# EAGLE design esp8266heaterv01 (EAGLE 8.0.2)
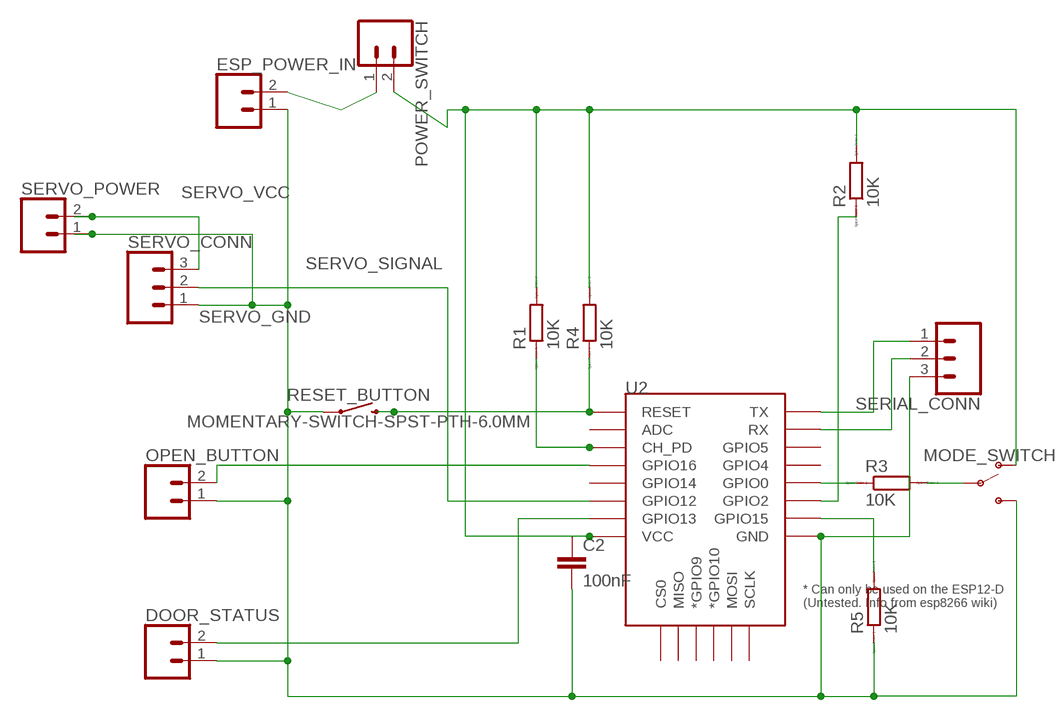
[diagram p0: schematic, sheet 1]

## Parts
C2  100nF  C-EU025-024X044  [C025-024X044]
DOOR_STATUS  CONN_02-JST-2-PTH-NO_SILK  [JST-2-PTH-NS]
ESP_POWER_IN  CONN_02JST-PTH-2  [JST-2-PTH]
MODE_SWITCH  SWITCH-SPDT-PTH-11.6X4.0MM  [SWITCH_SPDT_PTH_11.6X4.0MM]
OPEN_BUTTON  CONN_02-JST-2-PTH-NO_SILK  [JST-2-PTH-NS]
POWER_SWITCH  CONN_02-JST-2-PTH-NO_SILK  [JST-2-PTH-NS]
R1  10K  R0204/7  [0204/7]
R2  10K  R0204/7  [0204/7]
R3  10K  R0204/7  [0204/7]
R4  10K  R0204/7  [0204/7]
R5  10K  R0204/7  [0204/7]
RESET_BUTTON  MOMENTARY-SWITCH-SPST-PTH-6.0MM  [TACTILE_SWITCH_PTH_6.0MM]
SERIAL_CONN  CONN_03POGO_PIN_HOLES_ONLY  [1X03_PP_HOLES_ONLY]
SERVO_CONN  CONN_03  [1X03]
SERVO_POWER  CONN_02JST-PTH-2  [JST-2-PTH]
U2  ESP12ESMD  [ESP12E-SMD]

## Nets
N$1: C2.1 MODE_SWITCH.1(O) POWER_SWITCH.2 R1.2 R2.2 R4.2 U2.VCC
N$2: OPEN_BUTTON.2 U2.GPIO16
N$3: R3.1 U2.GPIO0
N$4: R4.1 RESET_BUTTON.3 U2.RESET
N$5: R1.1 U2.CH_PD
N$6: R5.2 U2.GPIO15
N$7: MODE_SWITCH.2(P) R3.2
N$8: SERIAL_CONN.1 U2.TXD0(TX)
N$9: SERIAL_CONN.2 U2.RXD0(RX)
N$10: DOOR_STATUS.2 U2.GPIO13
N$12: R2.1 U2.GPIO2
N$15: ESP_POWER_IN.2 POWER_SWITCH.1
N$17: C2.2 DOOR_STATUS.1 MODE_SWITCH.3(S) OPEN_BUTTON.1 R5.1 SERIAL_CONN.3 U2.GND
SERVO_GND: ESP_POWER_IN.1 RESET_BUTTON.1 SERVO_CONN.1 SERVO_POWER.1
SERVO_SIGNAL: SERVO_CONN.2 U2.GPIO12
SERVO_VCC: SERVO_CONN.3 SERVO_POWER.2
Unconnected: U2.ADC U2.CS0 U2.GPIO4 U2.GPIO5 U2.GPIO9(*GPIO9) U2.GPIO10(*GPIO10) U2.GPIO14 U2.MISO U2.MOSI U2.SCLK

## Library data of the parts
C2 = resistor:C-EU: CAPACITOR, European symbol
DOOR_STATUS OPEN_BUTTON POWER_SWITCH = SparkFun-Connectors:CONN_02: Multi connection point. Often used as Generic Header-pin footprint for 0.1 inch spaced/style header connections On any of the 0.1 inch spaced packages, you can populate with these: Break Away Headers - Straight <https://www.sparkfun.com/products/116> (PRT-00116) Break Away Male Headers - Right Angle <https://www.sparkfun.com/products/553> (PRT-00553) Female Headers <https://www.sparkfun.com/products/115> (PRT-00115) Break Away Headers - Machine Pin <https://www.sparkfun.com/products/117> (PRT-00117) Break Away Female Headers - Swiss Machine Pin <https://www.sparkfun.com/products/743> (PRT-00743) For SCREWTERMINALS and SPRING TERMINALS visit here: Screw Terimnals on SparkFun.com <https://www.sparkfun.com/search/results?term=Screw+Terminals> (5mm/3.5mm/2.54mm spacing) This device is also useful as a general connection point to wire up your design to another part of your project. Our various solder wires solder well into these plated through hole pads. Hook-Up Wire - Assortment (Stranded, 22 AWG) <https://www.sparkfun.com/products/11375> (PRT-11375) Hook-Up Wire - Assortment (Solid Core, 22 AWG) <https://www.sparkfun.com/products/11367> (PRT-11367) View the entire wire category on our website here <https://www.sparkfun.com/categories/141> Special notes: Molex polarized connector foot print use with: PRT-08233 with associated crimp pins and housings. 2.54_SCREWTERM for use with PRT-10571. 3.5mm Screw Terminal footprints for PRT-08084 5mm Screw Terminal footprints for use with PRT-08432
ESP_POWER_IN SERVO_POWER = sparkfun-con.:CONN_02: Multi connection point. Often used as Generic Header-pin footprint for 0.1 inch spaced/style header connections On any of the 0.1 inch spaced packages, you can populate with these: Break Away Headers - Straight <https://www.sparkfun.com/products/116> (PRT-00116) Break Away Male Headers - Right Angle <https://www.sparkfun.com/products/553> (PRT-00553) Female Headers <https://www.sparkfun.com/products/115> (PRT-00115) Break Away Headers - Machine Pin <https://www.sparkfun.com/products/117> (PRT-00117) Break Away Female Headers - Swiss Machine Pin <https://www.sparkfun.com/products/743> (PRT-00743) For SCREWTERMINALS and SPRING TERMINALS visit here: Screw Terimnals on SparkFun.com <https://www.sparkfun.com/search/results?term=Screw+Terminals> (5mm/3.5mm/2.54mm spacing) This device is also useful as a general connection point to wire up your design to another part of your project. Our various solder wires solder well into these plated through hole pads. Hook-Up Wire - Assortment (Stranded, 22 AWG) <https://www.sparkfun.com/products/11375> (PRT-11375) Hook-Up Wire - Assortment (Solid Core, 22 AWG) <https://www.sparkfun.com/products/11367> (PRT-11367) View the entire wire category on our website here <https://www.sparkfun.com/categories/141> Special notes: Molex polarized connector foot print use with: PRT-08233 with associated crimp pins and housings. 2.54_SCREWTERM for use with PRT-10571. 3.5mm Screw Terminal footprints for PRT-08084 5mm Screw Terminal footprints for use with PRT-08432; PROD_ID: CONN-09863; SKU: PRT-09914
MODE_SWITCH = SparkFun-Switches:SWITCH-SPDT: Single Pole, Double Throw (SPDT) Switch Single-pole, double-throw (SPDT) switch. Variant Overview SMD-AYZ0202 Surface Mount DPDT Switch <https://www.sparkfun.com/products/597> (COM-00597) Used on e.g. LilyPad Arduino USB - ATmega32U4 Board <https://www.sparkfun.com/products/12049> PTH-11.6X4.0MM SPDT Mini Power Switch <https://www.sparkfun.com/products/102> (COM-00102) Used on e.g. SparkFun Simon Says - Through-Hole Soldering Kit <https://www.sparkfun.com/products/10547> (KIT-10547) PTH-11.6X4.0MM-KIT KIT version of SPDT Mini Power Switch - Simplifies soldering by removing tStop of switch pins - only one side can be soldered. PTH-11.6X4.0MM-LOCK LOCK version of SPDT Mini Power Switch - Offset pins hold switch in place for easier soldering. SMD-RIGHT-ANGLE Surface Mount Right Angle Switch <https://www.sparkfun.com/products/10860> (COM-10860) Used on e.g. SparkFun ESP8266 Thing <https://www.sparkfun.com/products/13231>; PROD_ID: SWCH-08261; SF_SKU: COM-00102
R1-R5 = eagle-ltspice:R: RESISTOR, European symbol; SPICEMODEL: NONE; SPICEPREFIX: R
RESET_BUTTON = SparkFun-Switches:MOMENTARY-SWITCH-SPST: Momentary Switch (Pushbutton) - SPST Normally-open (NO) SPST momentary switches (buttons, pushbuttons). Variants PTH-12MM - 12mm square, through-hole Momentary Pushbutton Switch - 12mm Square <https://www.sparkfun.com/products/9190> (COM-09190) PTH-6.0MM, PTH-6.0MM-KIT - 6.0mm square, through-hole Mini Pushbutton Switch <https://www.sparkfun.com/products/97> (COM-00097) KIT package intended for soldering kit's - only one side of pads' copper is exposed. PTH-RIGHT-ANGLE-KIT - Right-angle, through-hole Right Angle Tactile Button <https://www.sparkfun.com/products/10791> - Used on SparkFun BigTime Watch Kit <https://www.sparkfun.com/products/11734> SMD-12MM - 12mm square, surface-mount Tactile Button - SMD (12mm) <https://www.sparkfun.com/products/12993> (COM-12993) Used on SparkFun PicoBoard <https://www.sparkfun.com/products/11888> SMD-4.5MM - 4.5mm Square Trackball Switch Used on SparkFun Blackberry Trackballer Breakout <https://www.sparkfun.com/products/13169> SMD-4.6MMX2.8MM - 4.60mm x 2.80mm, surface mount Used on SparkFun SAMD21 Mini Breakout <https://www.sparkfun.com/products/13664> SMD-5.2MM, SMD-5.2-REDUNDANT - 5.2mm square, surface-mount Mini Pushbutton Switch - SMD <https://www.sparkfun.com/products/8720> (COM-08720) Used on Arduino Pro Mini <https://www.sparkfun.com/products/11114> REDUNDANT package connects both switch circuits together SMD-6.0X3.5MM - 6.0 x 3.5mm, surface mount Momentary Reset Switch SMD <https://www.sparkfun.com/products/8229> (COM-08229) SMD-6.2MM-TALL - 6.2mm square, surface mount Tactile Button - SMD (6mm) <https://www.sparkfun.com/products/12992> Used on SparkFun Digital Sandbox <https://www.sparkfun.com/products/12651> SMD-RIGHT-ANGLE - Right-angle, surface mount Used on SparkFun Block for Intel® Edison - Arduino <https://www.sparkfun.com/products/13036>; PROD_ID: SWCH-08441; SF_SKU: COM-00097
SERIAL_CONN SERVO_CONN = SparkFun-Connectors:CONN_03: Multi connection point. Often used as Generic Header-pin footprint for 0.1 inch spaced/style header connections On any of the 0.1 inch spaced packages, you can populate with these: Break Away Headers - Straight <https://www.sparkfun.com/products/116> (PRT-00116) Break Away Male Headers - Right Angle <https://www.sparkfun.com/products/553> (PRT-00553) Female Headers <https://www.sparkfun.com/products/115> (PRT-00115) Break Away Headers - Machine Pin <https://www.sparkfun.com/products/117> (PRT-00117) Break Away Female Headers - Swiss Machine Pin <https://www.sparkfun.com/products/743> (PRT-00743) Stackable Header - 3 Pin (Female, 0.1") <https://www.sparkfun.com/products/13875> (PRT-13875) For SCREWTERMINALS and SPRING TERMINALS visit here: Screw Terimnals on SparkFun.com <https://www.sparkfun.com/search/results?term=Screw+Terminals> (5mm/3.5mm/2.54mm spacing) This device is also useful as a general connection point to wire up your design to another part of your project. Our various solder wires solder well into these plated through hole pads. Hook-Up Wire - Assortment (Stranded, 22 AWG) <https://www.sparkfun.com/products/11375> (PRT-11375) Hook-Up Wire - Assortment (Solid Core, 22 AWG) <https://www.sparkfun.com/products/11367> (PRT-11367) View the entire wire category on our website here <https://www.sparkfun.com/categories/141> Special notes: Molex polarized connector foot print use with SKU : PRT-08232 with associated crimp pins and housings.
U2 = esp8266modules:ESP12E: ESP12E Module

## Board
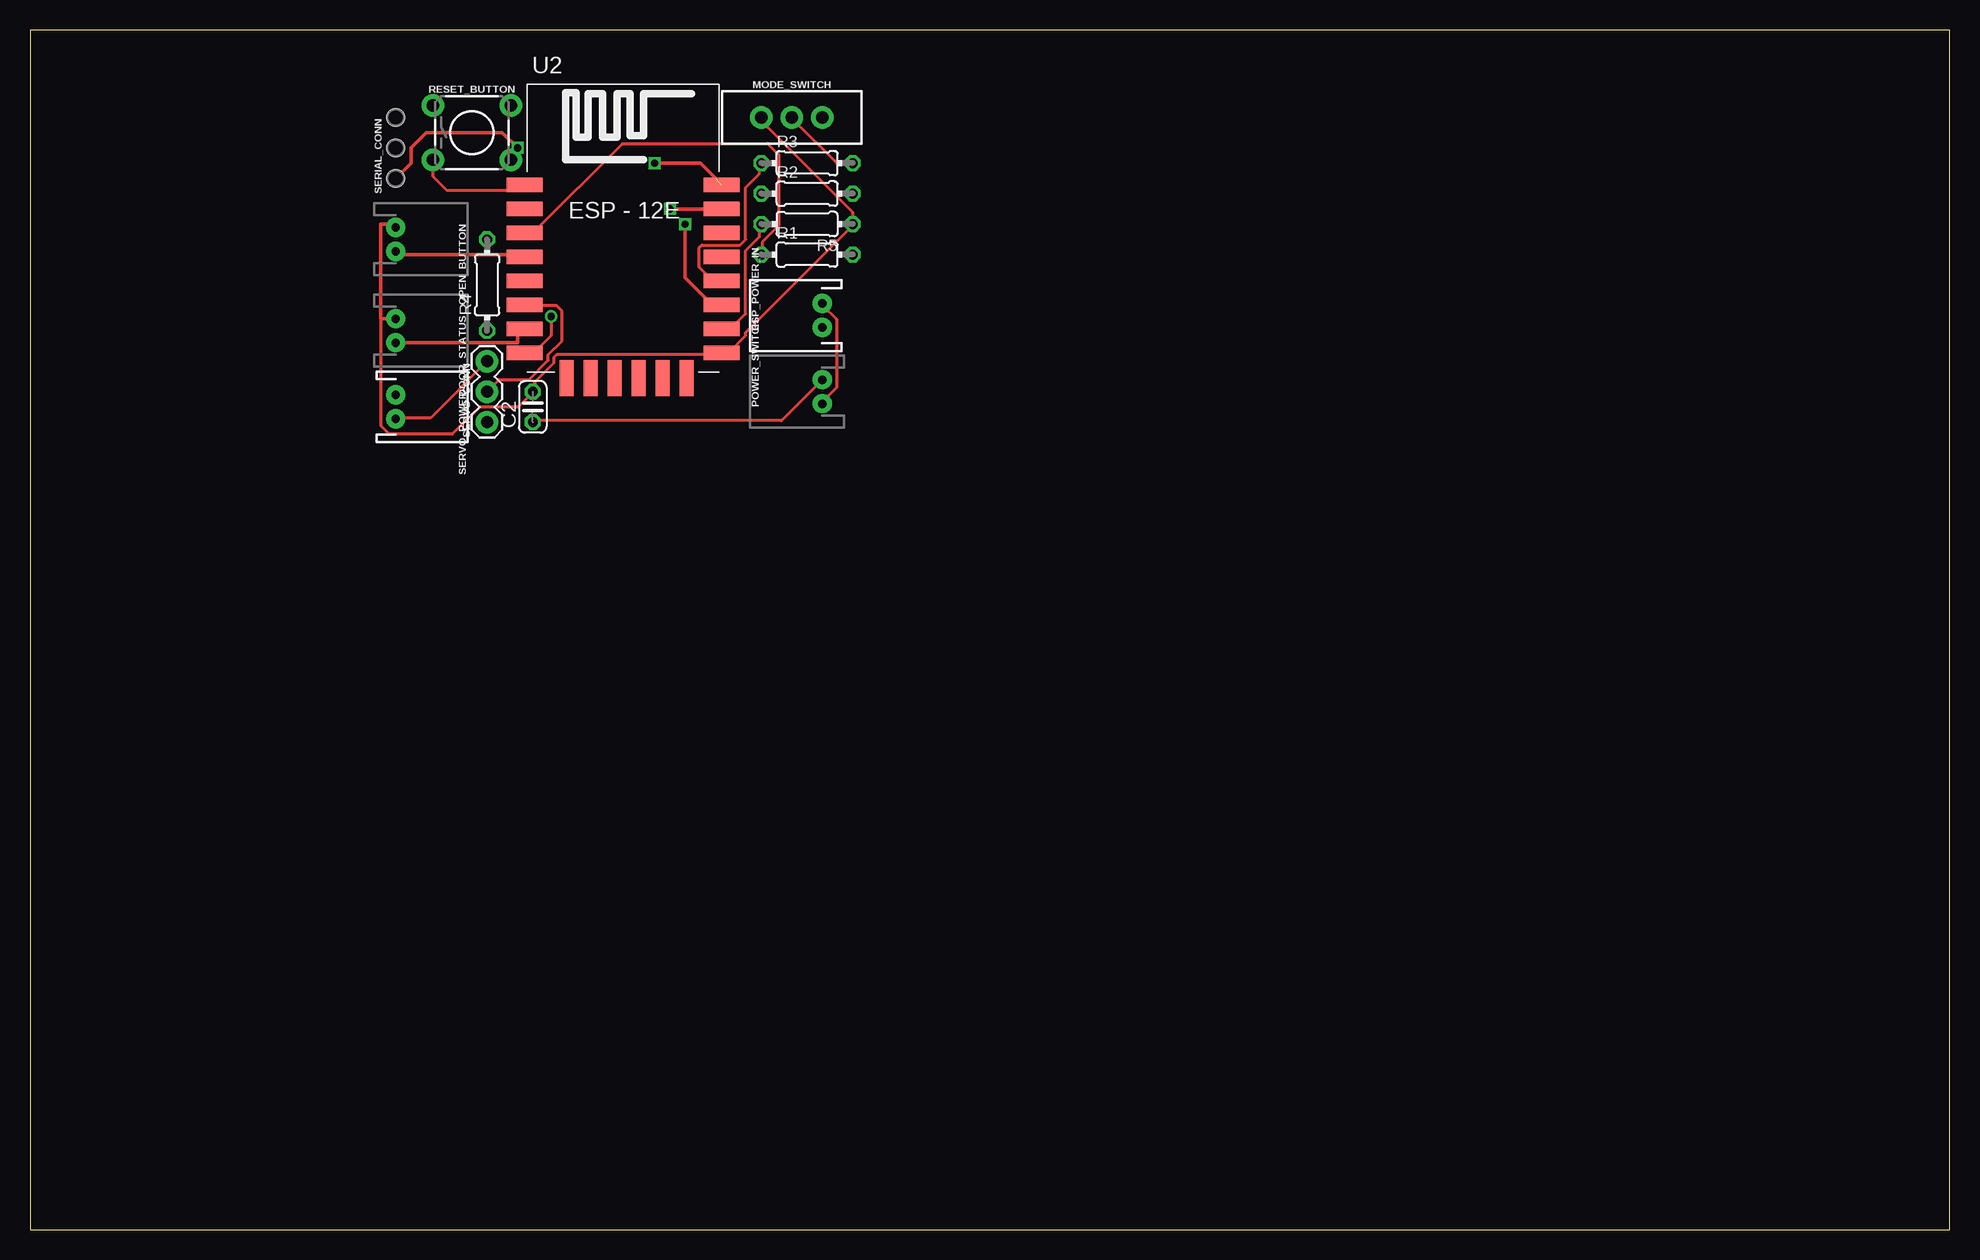
[diagram p1: board, top side]
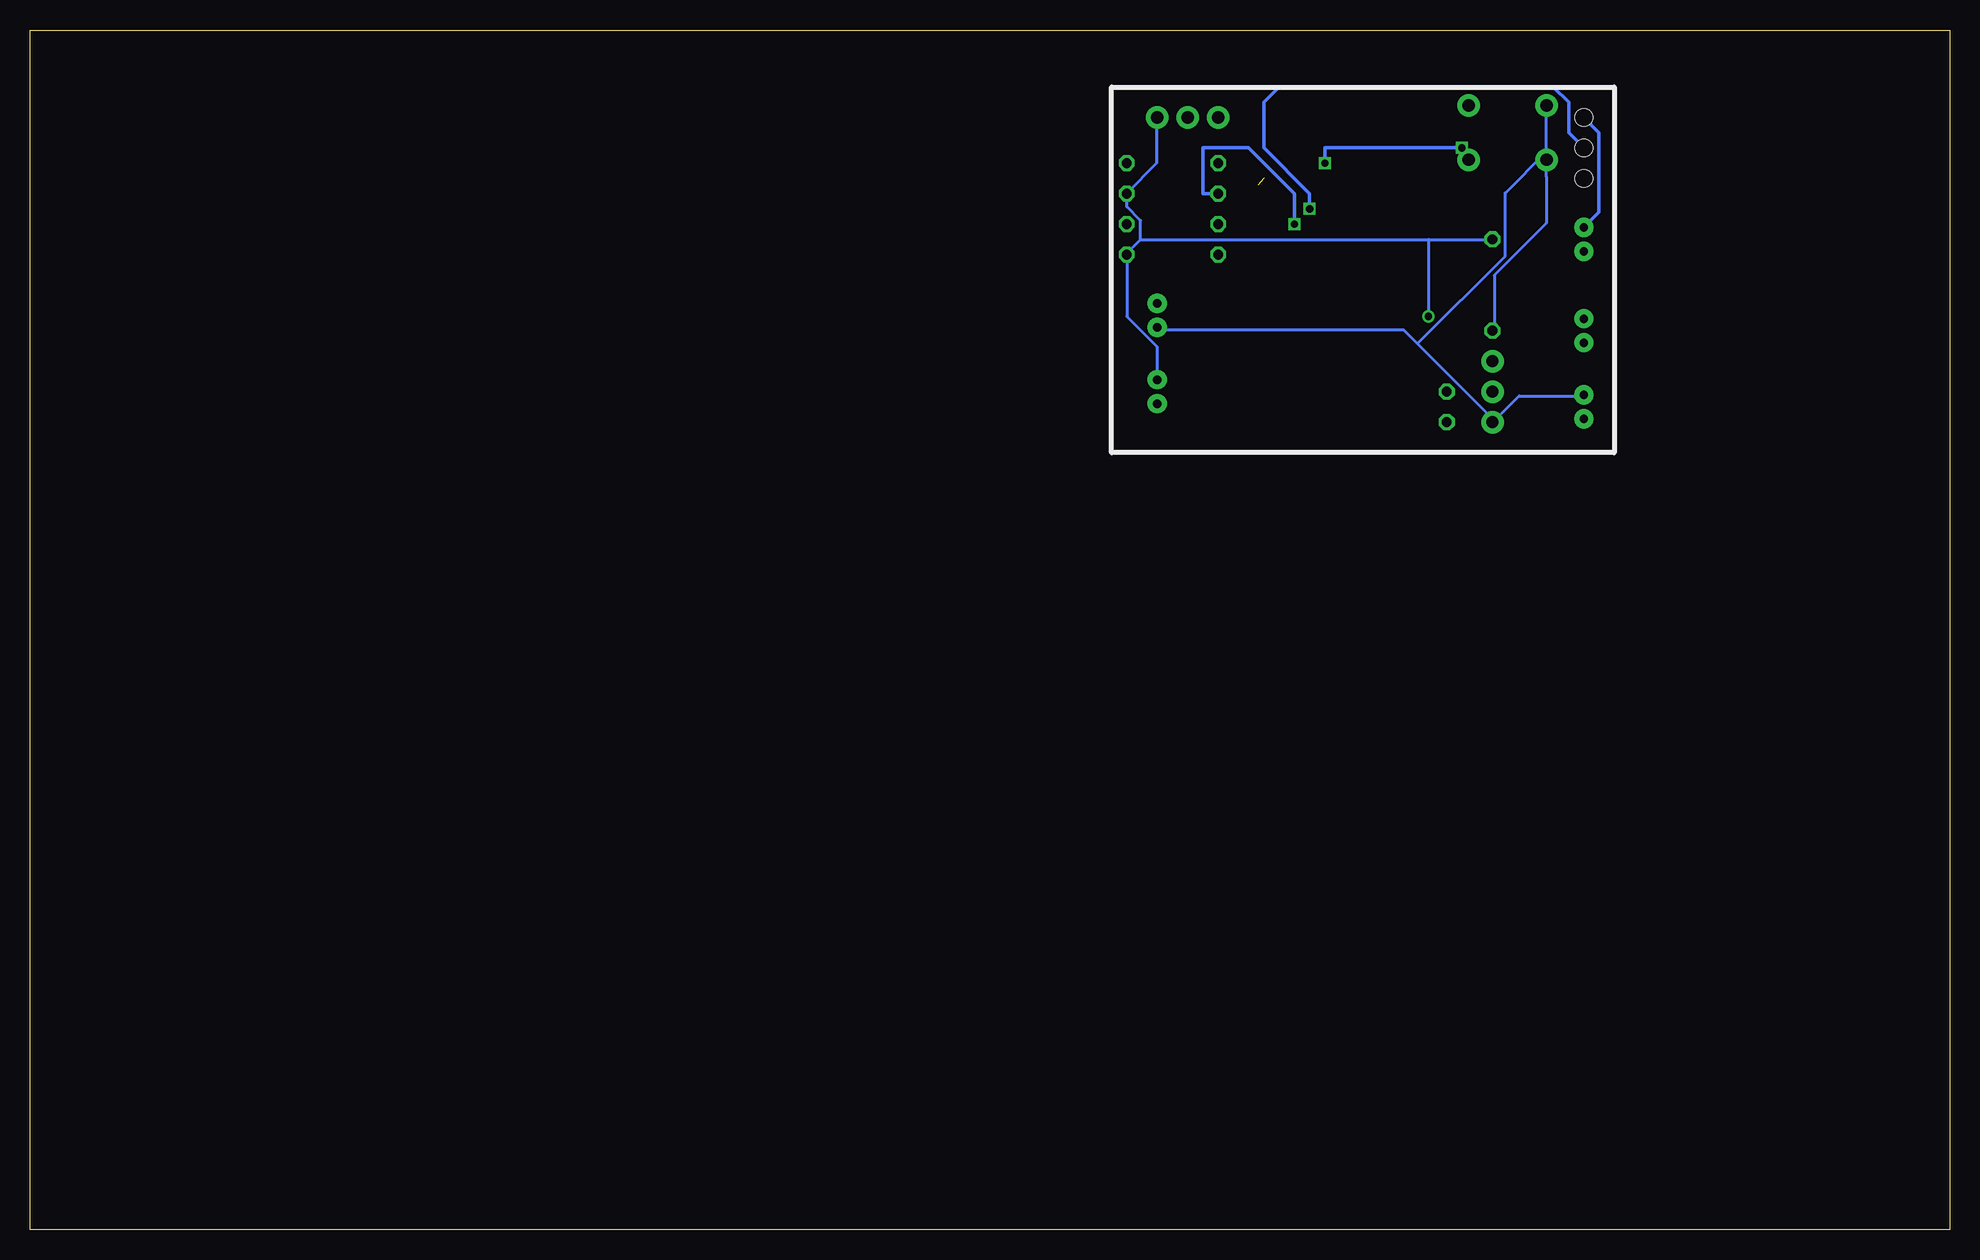
[diagram p2: board, bottom side, seen from below]

Size 160 x 100 mm. Coordinates in mm from the lower left corner, seen from the top.
Outline: 0,0 160,0 160,100 0,100 0,0
Copper layers (1*16): Top 0.035mm / dielectric 1.5mm / Bottom 0.035mm
Design rules "default": minimum track width 10mil, minimum drill 24mil, track to track 8mil, track to pad 8mil, pad to pad 8mil, via to via 8mil, smd to smd 8mil, copper to edge 40mil, drill to drill 8mil, minimum pad ring 10mil, minimum via ring 8mil, stop-mask expansion 4mil, vias tented up to drill 0mil, thermal gap 10mil

### Footprints (pad centres in the part's own frame; a part is rotated, then mirrored left to right if it is on the bottom)
C025-024X044 = drill 0.813 octagon: 1 -1.27,0; 2 1.27,0
JST-2-PTH-NS = drill 0.7 pad 1.6: 1 -1,0; 2 1,0
JST-2-PTH = drill 0.7 pad 1.6: 1 -1,0; 2 1,0
SWITCH_SPDT_PTH_11.6X4.0MM = drill 1.016 pad 1.88: 1 0,2.54; 2 0,0; 3 0,-2.54
0204/7 = drill 0.813 octagon: 1 -3.81,0; 2 3.81,0
TACTILE_SWITCH_PTH_6.0MM = drill 1.016 pad 1.88: 1 -3.251,2.261; 2 3.251,2.261; 3 -3.251,-2.261; 4 3.251,-2.261
1X03_PP_HOLES_ONLY = drill 0.9 pad 0.813: 1 0,0; 2 2.54,0; 3 5.08,0 | hole 1.473: 0,0; 2.54,0; 5.08,0
1X03 = drill 1.016 pad 1.88: 1 0,0; 2 2.54,0; 3 5.08,0
ESP12E-SMD = smd 3 x 1.2: ADC -8.3,3.8; CH_PD -8.3,1.8; GND 8.1,-8.2; GPIO0 8.1,-2.2; GPIO2 8.1,-4.2; GPIO4 8.1,-0.2; GPIO5 8.1,1.8; GPIO12 -8.3,-4.2; GPIO13 -8.3,-6.2; GPIO14 -8.3,-2.2; GPIO15 8.1,-6.2; GPIO16 -8.3,-0.2; RESET -8.3,5.8; RXD0 8.1,3.8; TXD0 8.1,5.8; VCC -8.3,-8.2 | smd 1.2 x 3: CS0 -4.8,-10.3; GPIO9 -0.8,-10.3; GPIO10 1.2,-10.3; MISO -2.8,-10.3; MOSI 3.2,-10.3; SCLK 5.2,-10.3

### Placement (x,y rotation side)
C2  41.91,68.58 90 top
DOOR_STATUS  30.48,74.93 270 top
ESP_POWER_IN  66.04,76.2 90 top
MODE_SWITCH  63.5,92.71 270 top
OPEN_BUTTON  30.48,82.55 270 top
POWER_SWITCH  66.04,69.85 90 top
R1  64.77,81.28 0 top
R2  64.77,86.36 0 top
R3  64.77,88.9 0 top
R4  38.1,78.74 90 top
R5  64.77,83.82 180 top
RESET_BUTTON  36.83,91.44 0 top
SERIAL_CONN  30.48,87.63 90 top
SERVO_CONN  38.1,67.31 90 top
SERVO_POWER  30.48,68.58 270 top
U2  49.53,81.28 0 top

### Tracks (layer width: path | path; a pad name or v marks a point on that pad's centre or on a via)
N$1  (via drill 0.61)
  Top 0.254: C2.1 42.06,67.44 62.64,67.44 65.84,70.64 POWER_SWITCH.2 | v43.43,76.12 43.43,74.52 42.06,73.15 41.38,73.15 U2.VCC
  Bottom 0.254: 67.44,82.53 43.43,82.53 | 43.43,82.53 38.18,82.53 R4.2 | 67.44,82.53 68.58,81.38 R1.2 68.58,76.12 66.06,73.61 66.06,70.87 POWER_SWITCH.2 | 67.44,82.53 67.44,84.12 68.58,85.27 R2.2 68.58,86.41 66.06,88.92 66.06,92.58 MODE_SWITCH.1 | 43.43,82.53 v43.43,76.12
N$2
  Top 0.254: U2.GPIO16 41.15,81.15 40.69,81.15 40.64,81.28
  Top 0.305: OPEN_BUTTON.2 30.75,81.28 40.64,81.28
N$3
  Top 0.254: R3.1 60.81,88.7 60.81,88.01 59.66,86.87 59.66,82.53 59.21,82.07 56.01,82.07 55.78,81.84 55.78,80.24 56.92,79.1 57.61,79.1 U2.GPIO0
N$4
  Top 0.254: U2.RESET 41.15,86.87 40.92,86.87 40.69,86.64 34.75,86.64 33.6,87.78 RESET_BUTTON.3
  Bottom 0.254: R4.1 37.95,74.98 37.95,79.55 33.6,83.9 33.6,87.78 RESET_BUTTON.3
N$5
  Top 0.254: R1.1 61.04,81.38 61.04,82.3 62.41,83.67 62.41,89.61 61.49,90.53 49.38,90.53 42.06,83.21 41.38,83.21 U2.CH_PD
N$6
  Top 0.254: R5.2 60.81,83.67 60.81,82.75 59.66,81.61 59.66,76.35 58.52,75.21 57.84,75.21 U2.GPIO15
N$7
  Top 0.254: R3.2 68.58,88.92 67.21,88.92 63.55,92.58 MODE_SWITCH.2
N$8  (via drill 0.6)  (1 unrouted)
  Top 0.305: SERIAL_CONN.1 31.75,88.9 31.75,90.17 33.02,91.44 39.37,91.44 v40.64,90.17 | v52.07,88.9 55.88,88.9 57.15,87.63
  Bottom 0.305: v40.64,90.17 52.07,90.17 v52.07,88.9
N$9  (via drill 0.6)
  Top 0.305: v53.34,85.09 v53.35,85.08 U2.RXD0
  Bottom 0.305: SERIAL_CONN.2 31.75,91.44 31.75,93.98 33.02,95.25 55.88,95.25 57.15,93.98 57.15,90.17 53.34,86.36 v53.34,85.09
N$10
  Top 0.254: U2.GPIO13 41.15,74.98 40.69,74.98 40.64,74.93
  Top 0.305: DOOR_STATUS.2 40.64,73.93 40.64,74.93
N$12  (via drill 0.6)
  Top 0.254: 56.69,77.27 57.61,77.27 U2.GPIO2
  Top 0.305: v54.61,83.82 54.61,79.35 56.69,77.27
  Bottom 0.305: R2.1 62.23,86.36 62.23,90.17 58.42,90.17 54.61,86.36 v54.61,83.82
N$15
  Top 0.254: POWER_SWITCH.1 66.06,69.04 67.21,70.18 67.21,75.89 66.06,77.04 ESP_POWER_IN.2
N$17
  Top 0.254: MODE_SWITCH.3 60.81,92.58 68.58,84.81 R5.1 68.58,83.67 59.66,74.75 59.66,74.52 58.29,73.15 57.84,73.15 U2.GND 57.61,72.92 43.89,72.92 43.66,72.69 43.66,72.24 42.06,70.64 42.06,69.95 C2.2 41.83,69.72 40.69,68.58 37.49,68.58 35.2,66.29 29.95,66.29 29.26,66.98 29.26,75.89 29.21,75.93
  Top 0.305: DOOR_STATUS.1 29.21,75.93 29.21,83.82 30.48,83.82 OPEN_BUTTON.1
  Bottom 0.305: SERIAL_CONN.3 29.21,91.44 29.21,84.82 OPEN_BUTTON.1
SERVO_GND
  Bottom 0.254: 37.95,67.44 35.89,69.49 30.63,69.49 SERVO_POWER.1 | 37.95,67.44 44.35,73.84 | 44.35,73.84 45.49,74.98 65.84,74.98 ESP_POWER_IN.1 | 37.95,67.44 SERVO_CONN.1 | 44.35,73.84 37.03,81.15 37.03,86.41 33.6,89.84 33.6,92.35 RESET_BUTTON.1
SERVO_SIGNAL
  Top 0.254: U2.GPIO12 41.38,77.04 43.89,77.04 44.35,76.58 44.35,74.07 43.2,72.92 43.2,72.47 41.6,70.87 39.09,70.87 38.18,69.95 SERVO_CONN.2
SERVO_VCC
  Top 0.254: SERVO_CONN.3 33.38,67.67 30.63,67.67 SERVO_POWER.2